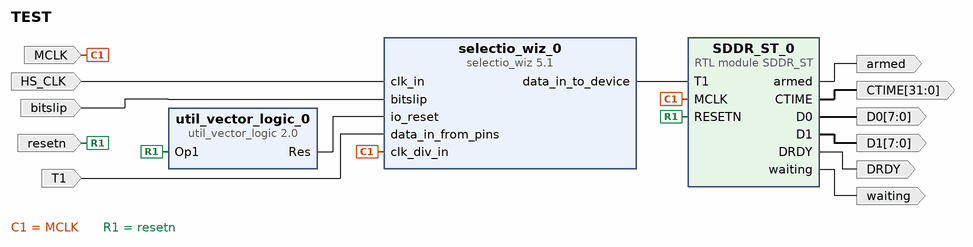
[diagram p0: block diagram of the top level]
# Vivado block design TEST, xc7z020clg400-1, Vivado 2019.1
create_bd_design TEST

create_bd_port -dir I -type clk HS_CLK
set_property -dict {CONFIG.FREQ_HZ 800000000} [get_bd_ports HS_CLK]
create_bd_port -dir I -type clk MCLK
set_property -dict {CONFIG.FREQ_HZ 400000000} [get_bd_ports MCLK]
create_bd_port -dir I -type rst resetn
create_bd_port -dir I bitslip
create_bd_port -dir I -type data T1
create_bd_port -dir O -from 7 -to 0 D0
create_bd_port -dir O -from 7 -to 0 D1
create_bd_port -dir O -type data DRDY
create_bd_port -dir O -from 31 -to 0 -type data CTIME
create_bd_port -dir O waiting
create_bd_port -dir O armed

create_bd_cell -type ip -vlnv xilinx.com:ip:selectio_wiz:5.1 selectio_wiz_0
set_property -dict [list \
  CONFIG.BUS_IO_STD LVCMOS33 \
  CONFIG.CLK_FWD_IO_STD LVCMOS33 \
  CONFIG.SELIO_ACTIVE_EDGE DDR \
  CONFIG.SELIO_CLK_BUF MMCM \
  CONFIG.SELIO_CLK_IO_STD LVCMOS33 \
  CONFIG.SELIO_INTERFACE_TYPE NETWORKING \
  CONFIG.SERIALIZATION_FACTOR 4 \
  CONFIG.USE_SERIALIZATION true \
] [get_bd_cells selectio_wiz_0]
create_bd_cell -type ip -vlnv xilinx.com:ip:util_vector_logic:2.0 util_vector_logic_0
set_property -dict {CONFIG.C_OPERATION not CONFIG.C_SIZE 1} [get_bd_cells util_vector_logic_0]
create_bd_cell -type module -reference SDDR_ST SDDR_ST_0
set_property -dict {CONFIG.SIG_WIDTH 8} [get_bd_cells SDDR_ST_0]

# ---- connections ----

connect_bd_net [get_bd_pins selectio_wiz_0/data_in_to_device] [get_bd_pins SDDR_ST_0/T1]
connect_bd_net [get_bd_ports HS_CLK] [get_bd_pins selectio_wiz_0/clk_in]
connect_bd_net [get_bd_ports MCLK] [get_bd_pins selectio_wiz_0/clk_div_in] [get_bd_pins SDDR_ST_0/MCLK]
connect_bd_net [get_bd_ports resetn] [get_bd_pins util_vector_logic_0/Op1] [get_bd_pins SDDR_ST_0/RESETN]
connect_bd_net [get_bd_pins util_vector_logic_0/Res] [get_bd_pins selectio_wiz_0/io_reset]
connect_bd_net [get_bd_ports bitslip] [get_bd_pins selectio_wiz_0/bitslip]
connect_bd_net -net T1_1 [get_bd_ports T1] [get_bd_pins selectio_wiz_0/data_in_from_pins]
connect_bd_net [get_bd_pins SDDR_ST_0/D0] [get_bd_ports D0]
connect_bd_net [get_bd_pins SDDR_ST_0/D1] [get_bd_ports D1]
connect_bd_net [get_bd_pins SDDR_ST_0/DRDY] [get_bd_ports DRDY]
connect_bd_net [get_bd_pins SDDR_ST_0/CTIME] [get_bd_ports CTIME]
connect_bd_net [get_bd_pins SDDR_ST_0/waiting] [get_bd_ports waiting]
connect_bd_net [get_bd_pins SDDR_ST_0/armed] [get_bd_ports armed]

validate_bd_design
save_bd_design
